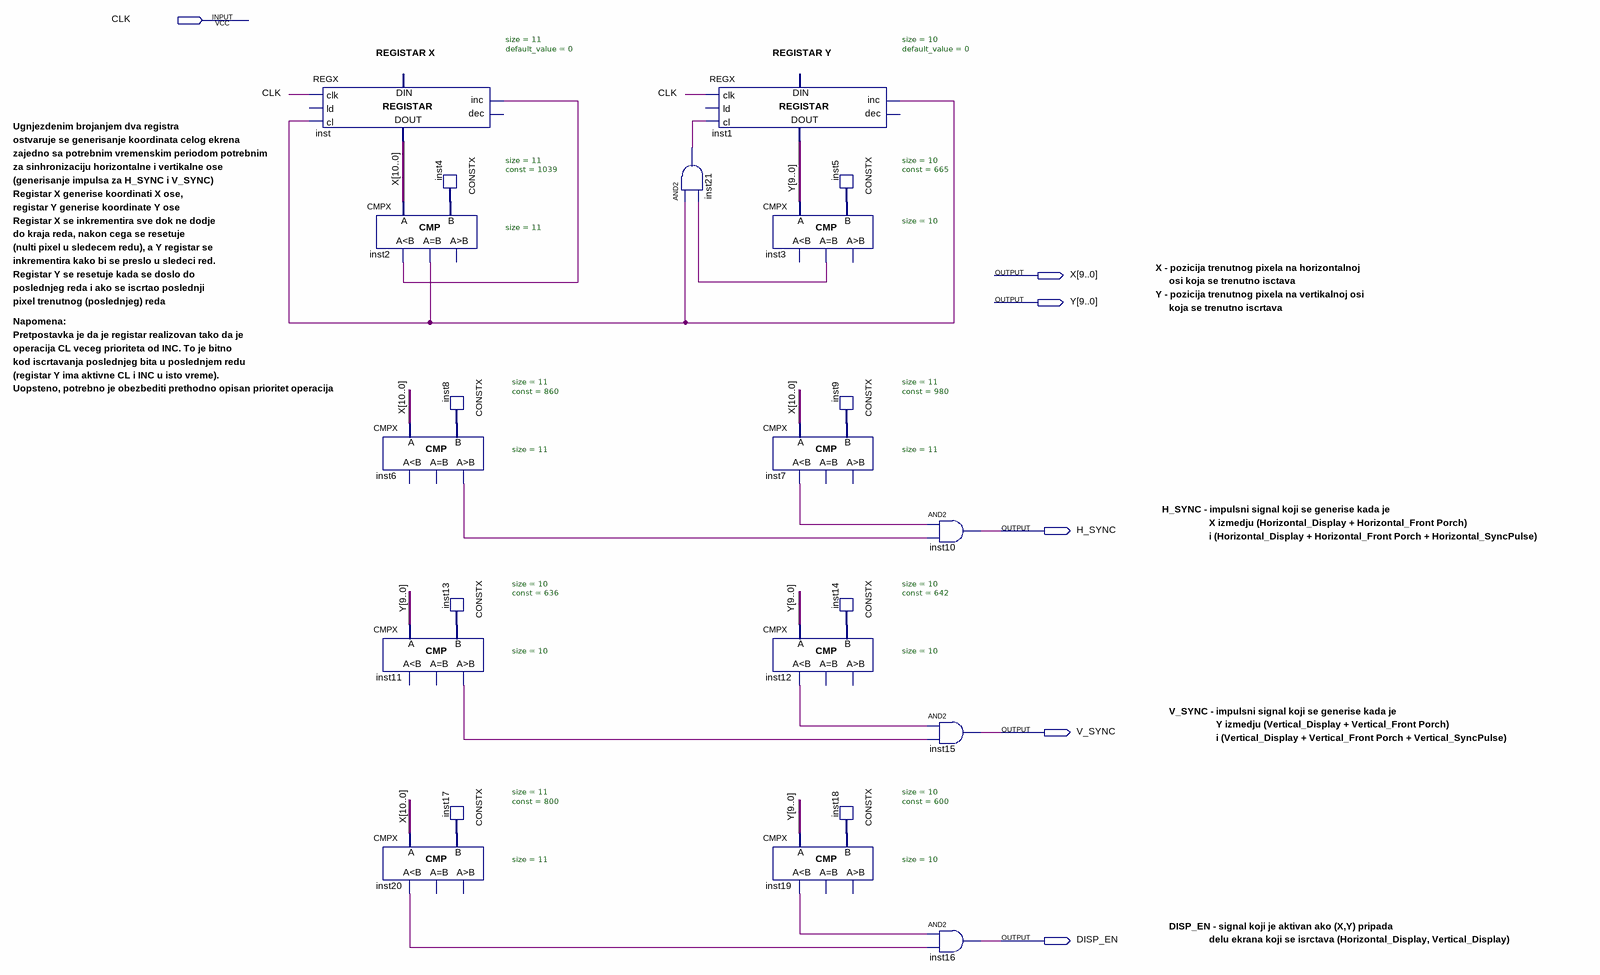
[diagram p0: schematic sheet]
// Quartus schematic VGAController.bdf as structural Verilog: 22 symbols, 6 pins
module VGAController (
  input  CLK,
  output [10:0] X,
  output [9:0] Y,
  output H_SYNC,
  output V_SYNC,
  output DISP_EN
);

  wire inst2_eq, inst2_ls, inst3_eq, inst6_gr, inst7_ls, inst11_gr, inst12_ls, inst19_ls, inst20_ls,
       inst21_out;
  wire [9:0] inst5_data, inst13_data, inst14_data, inst18_data;
  wire [10:0] inst4_data, inst8_data, inst9_data, inst17_data;

  REGX #(.size(11), .default_value(0)) inst (
    .clk(CLK), .cl(inst2_eq), .inc(inst2_ls), .data_out(X));  // open: ld, dec, data_in
  CMPX #(.size(11)) inst2 (.A(X), .B(inst4_data), .ls(inst2_ls), .eq(inst2_eq));  // open: gr
  CMPX #(.size(11)) inst6 (.A(X), .B(inst8_data), .gr(inst6_gr));  // open: ls, eq
  CMPX #(.size(10)) inst11 (.A(Y), .B(inst13_data), .gr(inst11_gr));  // open: ls, eq
  CMPX #(.size(11)) inst20 (.A(X), .B(inst17_data), .ls(inst20_ls));  // open: eq, gr
  CONSTX #(.size(11), .\const (1039)) inst4 (.data(inst4_data));
  CONSTX #(.size(11), .\const (860)) inst8 (.data(inst8_data));
  CONSTX #(.size(10), .\const (636)) inst13 (.data(inst13_data));
  CONSTX #(.size(11), .\const (800)) inst17 (.data(inst17_data));
  REGX #(.size(10), .default_value(0)) inst1 (
    .clk(CLK), .cl(inst21_out), .inc(inst2_eq), .data_out(Y));  // open: ld, dec, data_in
  and inst21 (inst21_out, inst2_eq, inst3_eq);
  CMPX #(.size(10)) inst3 (.A(Y), .B(inst5_data), .eq(inst3_eq));  // open: ls, gr
  CMPX #(.size(11)) inst7 (.A(X), .B(inst9_data), .ls(inst7_ls));  // open: eq, gr
  CMPX #(.size(10)) inst12 (.A(Y), .B(inst14_data), .ls(inst12_ls));  // open: eq, gr
  CMPX #(.size(10)) inst19 (.A(Y), .B(inst18_data), .ls(inst19_ls));  // open: eq, gr
  CONSTX #(.size(10), .\const (665)) inst5 (.data(inst5_data));
  CONSTX #(.size(11), .\const (980)) inst9 (.data(inst9_data));
  CONSTX #(.size(10), .\const (642)) inst14 (.data(inst14_data));
  CONSTX #(.size(10), .\const (600)) inst18 (.data(inst18_data));
  and inst10 (H_SYNC, inst7_ls, inst6_gr);
  and inst15 (V_SYNC, inst12_ls, inst11_gr);
  and inst16 (DISP_EN, inst19_ls, inst20_ls);

  // Notes on the sheet:
  //   REGISTAR X
  //   REGISTAR Y
  //   Ugnjezdenim brojanjem dva registra
  //   ostvaruje se generisanje koordinata celog ekrena
  //   zajedno sa potrebnim vremenskim periodom potrebnim
  //   za sinhronizaciju horizontalne i vertikalne ose
  //   (generisanje impulsa za H_SYNC i V_SYNC)
  //   Registar X generise koordinati X ose,
  //   registar Y generise koordinate Y ose
  //   Registar X se inkrementira sve dok ne dodje
  //   do kraja reda, nakon cega se resetuje
  //   (nulti pixel u sledecem redu), a Y registar se
  //   inkrementira kako bi se preslo u sledeci red.
  //   X - pozicija trenutnog pixela na horizontalnoj 
  //   Registar Y se resetuje kada se doslo do
  //   osi koja se trenutno isctava
  //   poslednjeg reda i ako se iscrtao poslednji
  //   Y - pozicija trenutnog pixela na vertikalnoj osi
  //   pixel trenutnog (poslednjeg) reda
  //   koja se trenutno iscrtava
  //   Napomena:
  //   Pretpostavka je da je registar realizovan tako da je
  //   operacija CL veceg prioriteta od INC. To je bitno 
  //   kod iscrtavanja poslednjeg bita u poslednjem redu
  //   (registar Y ima aktivne CL i INC u isto vreme).
  //   Uopsteno, potrebno je obezbediti prethodno opisan prioritet operacija
  //   H_SYNC - impulsni signal koji se generise kada je
  //   X izmedju (Horizontal_Display + Horizontal_Front Porch)
  //   i (Horizontal_Display + Horizontal_Front Porch + Horizontal_SyncPulse)
  //   V_SYNC - impulsni signal koji se generise kada je
  //   Y izmedju (Vertical_Display + Vertical_Front Porch)
  //   i (Vertical_Display + Vertical_Front Porch + Vertical_SyncPulse)
  //   DISP_EN - signal koji je aktivan ako (X,Y) pripada
  //   delu ekrana koji se isrctava (Horizontal_Display, Vertical_Display)
endmodule
